# EasyEDA schematic SCH_Flight-Computer-V2_2024-07-15.json
TITLE: Flight Computer Schematic; REV: 1.0; Date: 2024-07-14; Sheet: 1/1; Drawn By: usedgenes; Company: Your Company
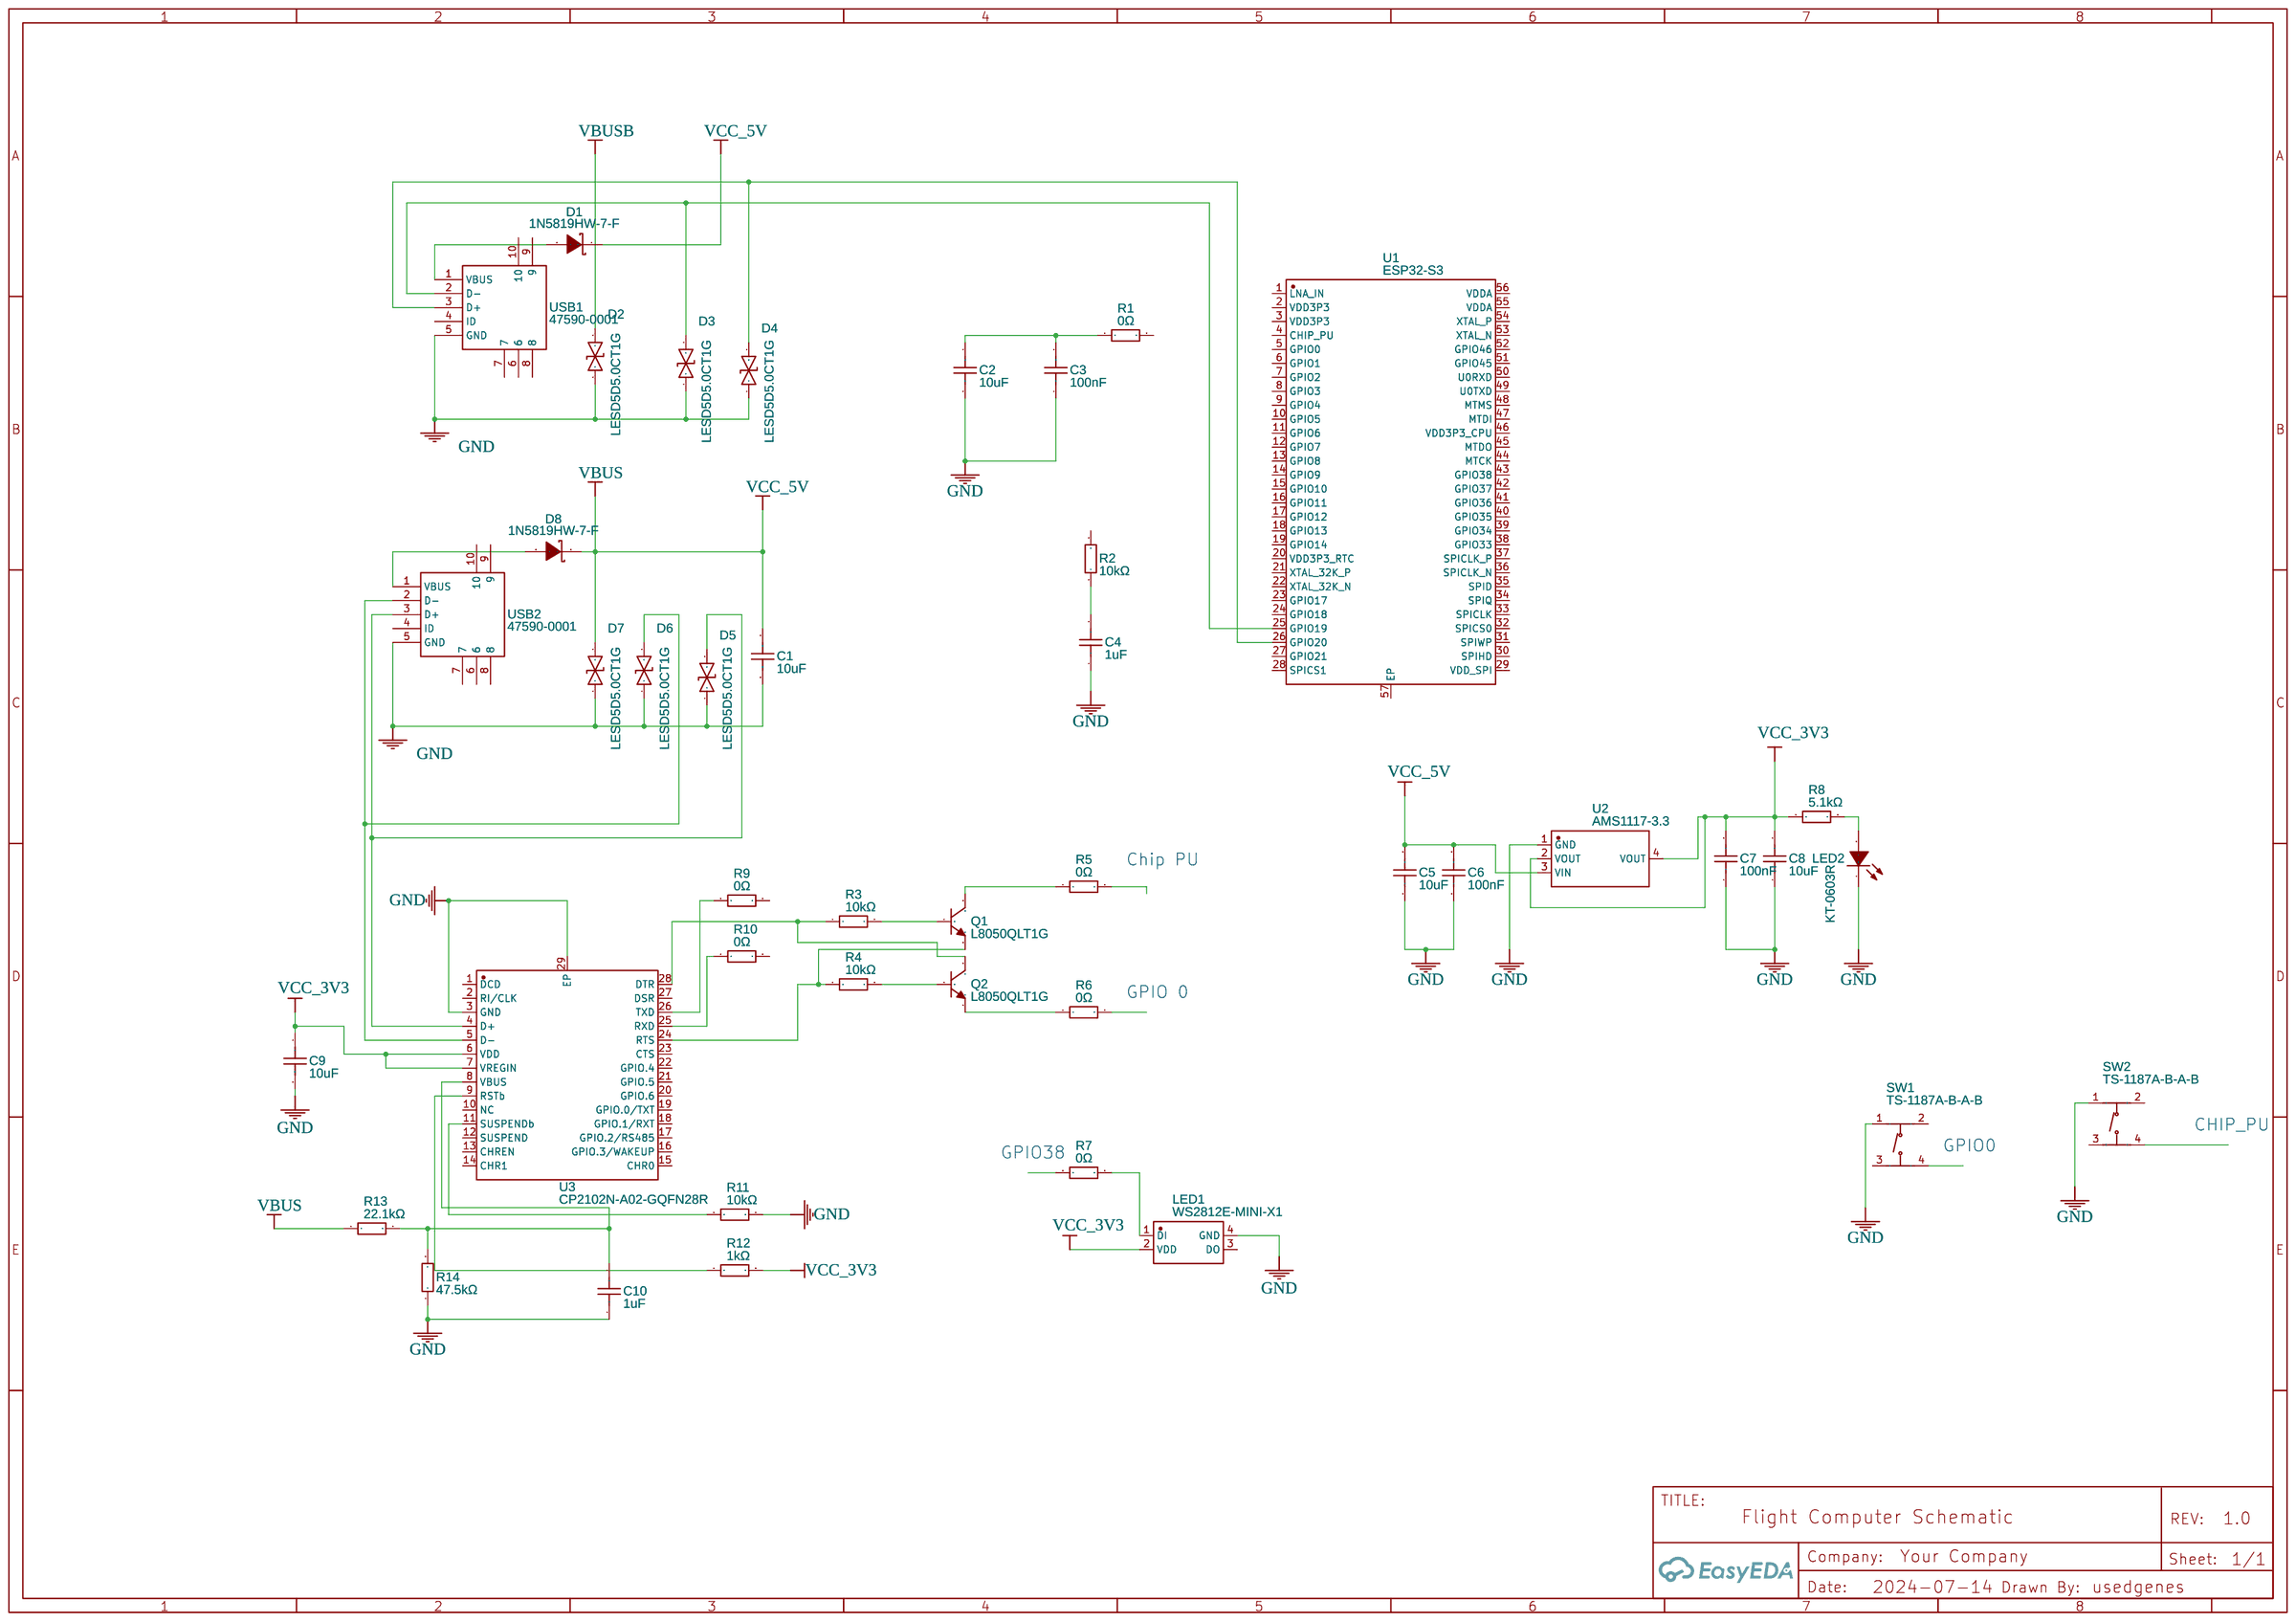
[diagram p0: schematic sheet]

## Parts
C1  10uF  [C0603]
C2  10uF  [C0603]
C3  100nF  [C0603]
C4  1uF  [C0603]
C5  10uF  [C0603]
C6  100nF  [C0603]
C7  100nF  [C0603]
C8  10uF  [C0603]
C9  10uF  [C0603]
C10  1uF  [C0603]
D1  1N5819HW-7-F  [SOD-123_L2.7-W1.6-LS3.7-RD]
D2  LESD5D5.0CT1G  [SOD-523_L1.2-W0.8-LS1.6-BI]
D3  LESD5D5.0CT1G  [SOD-523_L1.2-W0.8-LS1.6-BI]
D4  LESD5D5.0CT1G  [SOD-523_L1.2-W0.8-LS1.6-BI]
D5  LESD5D5.0CT1G  [SOD-523_L1.2-W0.8-LS1.6-BI]
D6  LESD5D5.0CT1G  [SOD-523_L1.2-W0.8-LS1.6-BI]
D7  LESD5D5.0CT1G  [SOD-523_L1.2-W0.8-LS1.6-BI]
D8  1N5819HW-7-F  [SOD-123_L2.7-W1.6-LS3.7-RD]
LED1  WS2812E-MINI-X1  [LED-SMD_4P-L3.7-W3.5-P1.75-BR-SK6812MINI]
LED2  KT-0603R  [LED0603-RD]
Q1  L8050QLT1G  [SOT-23-3_L2.9-W1.3-P1.90-LS2.4-BR]
Q2  L8050QLT1G  [SOT-23-3_L2.9-W1.3-P1.90-LS2.4-BR]
R1  0Ω  [R0402]
R2  10kΩ  [R0603]
R3  10kΩ  [R0603]
R4  10kΩ  [R0603]
R5  0Ω  [R0402]
R6  0Ω  [R0402]
R7  0Ω  [R0402]
R8  5.1kΩ  [R0603]
R9  0Ω  [R0402]
R10  0Ω  [R0402]
R11  10kΩ  [R0603]
R12  1kΩ  [R0603]
R13  22.1kΩ  [R0402]
R14  47.5kΩ  [R0603]
SW1  TS-1187A-B-A-B  [SW-SMD_4P-L5.1-W5.1-P3.70-LS6.5-TL-2]
SW2  TS-1187A-B-A-B  [SW-SMD_4P-L5.1-W5.1-P3.70-LS6.5-TL-2]
U1  ESP32-S3  [QFN-56_L7.0-W7.0-P0.40-TL-EP4.0]
U2  AMS1117-3.3  [SOT-223-3_L6.5-W3.4-P2.30-LS7.0-BR]
U3  CP2102N-A02-GQFN28R  [QFN-28_L5.0-W5.0-P0.50-TL-EP3.3]
USB1  47590-0001  [MICRO-USB-SMD_47590-0001]
USB2  47590-0001  [MICRO-USB-SMD_47590-0001]

## Library data of the parts
C1 C2 C5 C8 C9 = CL10A106KP8NNNC: Supplier: LCSC; Manufacturer: SAMSUNG(三星); Supplier Part: C19702; JLCPCB Part Class: Basic Part
C3 C6 C7 = CC0603KRX7R9BB104: Supplier: LCSC; Manufacturer: YAGEO(国巨); Supplier Part: C14663; JLCPCB Part Class: Basic Part
C4 C10 = CL10A105KB8NNNC: Supplier: LCSC; Manufacturer: SAMSUNG(三星); Supplier Part: C15849; JLCPCB Part Class: Basic Part; link: https://lcsc.com/eda_search?q=C15849&%26type=1&ref=editor
D1 D8 = 1N5819HW-7-F: Supplier: LCSC; Manufacturer: DIODES(美台); Supplier Part: C82544; JLCPCB Part Class: Extended Part
D2-D7 = LESD5D5.0CT1G: Contributor: LCSC; Supplier: LCSC; Supplier Part: C383211; Manufacturer: LRC(乐山无线电); JLCPCB Part Class: Extended Part
LED1 = WS2812E-MINI-X1: Contributor: lcsc; Supplier: LCSC; Supplier Part: C4154871; Manufacturer: worldsemi; JLCPCB Part Class: Extended Part
LED2 = KT-0603R: Supplier: LCSC; Manufacturer: KENTO; Supplier Part: C2286; JLCPCB Part Class: Basic Part
Q1 Q2 = L8050QLT1G: Supplier: LCSC; Manufacturer: LRC(乐山无线电); Supplier Part: C49581; JLCPCB Part Class: Extended Part
R1 R5-R7 R9 R10 = 0402WGF0000TCE: Supplier: LCSC; Manufacturer: UNI-ROYAL(厚声); Supplier Part: C17168; JLCPCB Part Class: Basic Part
R2-R4 R11 = 0603WAF1002T5E: Supplier: LCSC; Manufacturer: UNI-ROYAL(厚声); Supplier Part: C25804; JLCPCB Part Class: Basic Part
R8 = 0603WAF5101T5E: Supplier: LCSC; Manufacturer: UNI-ROYAL(厚声); Supplier Part: C23186; JLCPCB Part Class: Basic Part
R12 = 0603WAF1001T5E: Supplier: LCSC; Manufacturer: UNI-ROYAL(厚声); Supplier Part: C21190; JLCPCB Part Class: Basic Part
R13 = 0402WGF2212TCE: Supplier: LCSC; Manufacturer: UNI-ROYAL(厚声); Supplier Part: C43473; JLCPCB Part Class: Extended Part
R14 = 0603WAF4752T5E: Supplier: LCSC; Manufacturer: UNI-ROYAL(厚声); Supplier Part: C23061; JLCPCB Part Class: Extended Part
SW1 SW2 = TS-1187A-B-A-B: Contributor: LCSC; Supplier: LCSC; Supplier Part: C318884; Manufacturer: XKB Connectivity(中国星坤); JLCPCB Part Class: Basic Part
U1 = ESP32-S3: Contributor: LCSC; Supplier: LCSC; Supplier Part: C2913192; Manufacturer: ESPRESSIF(乐鑫); JLCPCB Part Class: Extended Part
U2 = AMS1117-3.3: sourceId: dwIGgezVh; Supplier: LCSC; Manufacturer: AMS; Supplier Part: C6186; JLCPCB Part Class: Basic Part
U3 = CP2102N-A02-GQFN28R: Contributor: LCSC; Supplier: LCSC; Supplier Part: C964632; Manufacturer: SKYWORKS/SILICON LABS(芯科); JLCPCB Part Class: Extended Part
USB1 USB2 = 47590-0001: Contributor: LCSC; Supplier: LCSC; Manufacturer: MOLEX; Manufacturer Part: 475900001; Supplier Part: C136001; JLCPCB Part Class: Extended Part

## Nets
GND: C1.2 C2.2 C3.1 C4.1 C5.1 C6.1 C7.1 C8.1 C9.2 C10.1 D2.1 D3.1 D4.1 D5.1 D6.1 D7.1 LED1.4(GND) LED2.1(K) R11.2 R14.1 SW1.1(A) SW2.1(A) U2.1(GND) U3.3(GND) U3.29(EP) USB1.5(GND) USB2.5(GND)
VBUS: C1.1 C5.2 C6.2 D1.1(K) D7.2 D8.1(K) R13.1 U2.3(VIN)
VBUSB: D2.2
VCC_3V3: C7.2 C8.2 C9.1 LED1.2(VDD) R8.1 R12.2 U2.2(VOUT) U2.4(VOUT) U3.6(VDD) U3.7(VREGIN)
Net-(C2-1): C2.1 C3.2 R1.1
Net-(C4-2): C4.2 R2.1
Net-(C10-2): C10.2 R13.2 R14.2 U3.8(VBUS)
Net-(D1-2): D1.2(A) USB1.1(VBUS)
Net-(D3-2): D3.2 U1.25(GPIO19) USB1.2(D-)
Net-(D4-2): D4.2 U1.26(GPIO20) USB1.3(D+)
Net-(D5-2): D5.2 U3.4(D+) USB2.3(D+)
Net-(D6-2): D6.2 U3.5(D-) USB2.2(D-)
Net-(D8-2): D8.2(A) USB2.1(VBUS)
Net-(LED1-1): LED1.1(DI) R7.2
Net-(LED2-2): LED2.2(A) R8.2
Net-(Q1-1): Q1.1(B) R3.2
Net-(Q1-2): Q1.2(E) R4.1 U3.24(RTS)
Net-(Q1-3): Q1.3(C) R5.1
Net-(Q2-1): Q2.1(B) R4.2
Net-(Q2-2): Q2.2(E) R6.1
Net-(Q2-3): Q2.3(C) R3.1 U3.28(DTR)
Net-(R9-1): R9.1 U3.26(TXD)
Net-(R10-1): R10.1 U3.25(RXD)
Net-(R11-1): R11.1 U3.11(SUSPENDb)
Net-(R12-1): R12.1 U3.9(RSTb)

Not connected (* = marked no-connect by the designer): LED1 3(DO); R1 2; R2 2; R5 2; R6 2; R7 1; R9 2; R10 2; SW1 2(B) 3(C) 4(D); SW2 2(B) 3(C) 4(D); U1 1(LNA_IN) 2(VDD3P3) 3(VDD3P3) 4(CHIP_PU) 5(GPIO0) 6(GPIO1) 7(GPIO2) 8(GPIO3) 9(GPIO4) 10(GPIO5) 11(GPIO6) 12(GPIO7) 13(GPIO8) 14(GPIO9) 15(GPIO10) 16(GPIO11) 17(GPIO12) 18(GPIO13) 19(GPIO14) 20(VDD3P3_RTC) 21(XTAL_32K_P) 22(XTAL_32K_N) 23(GPIO17) 24(GPIO18) 27(GPIO21) 28(SPICS1) 29(VDD_SPI) 30(SPIHD) 31(SPIWP) 32(SPICS0) 33(SPICLK) 34(SPIQ) 35(SPID) 36(SPICLK_N) 37(SPICLK_P) 38(GPIO33) 39(GPIO34) 40(GPIO35) 41(GPIO36) 42(GPIO37) 43(GPIO38) 44(MTCK) 45(MTDO) 46(VDD3P3_CPU) 47(MTDI) 48(MTMS) 49(U0TXD) 50(U0RXD) 51(GPIO45) 52(GPIO46) 53(XTAL_N) 54(XTAL_P) 55(VDDA) 56(VDDA) 57(EP); U3 1(DCD) 2(RI/CLK) 10(NC) 12(SUSPEND) 13(CHREN) 14(CHR1) 15(CHR0) 16(GPIO.3/WAKEUP) 17(GPIO.2/RS485) 18(GPIO.1/RXT) 19(GPIO.0/TXT) 20(GPIO.6) 21(GPIO.5) 22(GPIO.4) 23(CTS) 27(DSR); USB1 4(ID) 6 7 8 9 10; USB2 4(ID) 6 7 8 9 10

## Notes on the sheet
- Chip PU
- GPIO 0
- CHIP_PU
- GPIO38
- GPIO0
